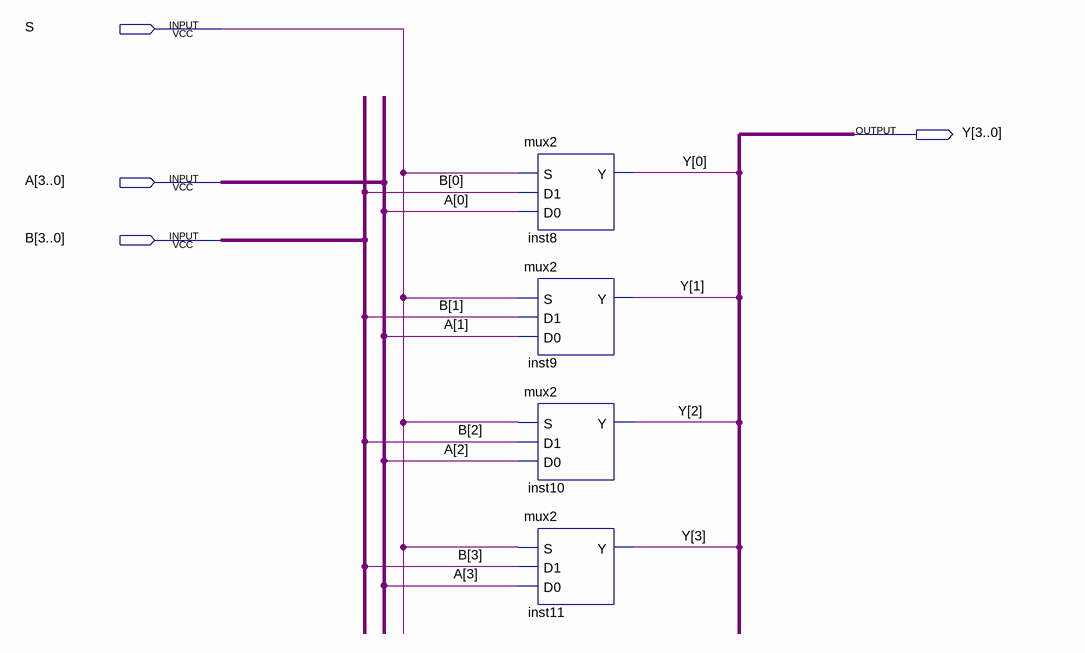
[diagram p0: schematic sheet]
// Quartus schematic mux2_4bits.bdf as structural Verilog: 4 symbols, 4 pins
module mux2_4bits (
  input  S,
  input  [3:0] A,
  input  [3:0] B,
  output [3:0] Y
);

  mux2 inst8 (.S(S), .D1(B[0]), .D0(A[0]), .Y(Y[0]));
  mux2 inst9 (.S(S), .D1(B[1]), .D0(A[1]), .Y(Y[1]));
  mux2 inst10 (.S(S), .D1(B[2]), .D0(A[2]), .Y(Y[2]));
  mux2 inst11 (.S(S), .D1(B[3]), .D0(A[3]), .Y(Y[3]));
endmodule
